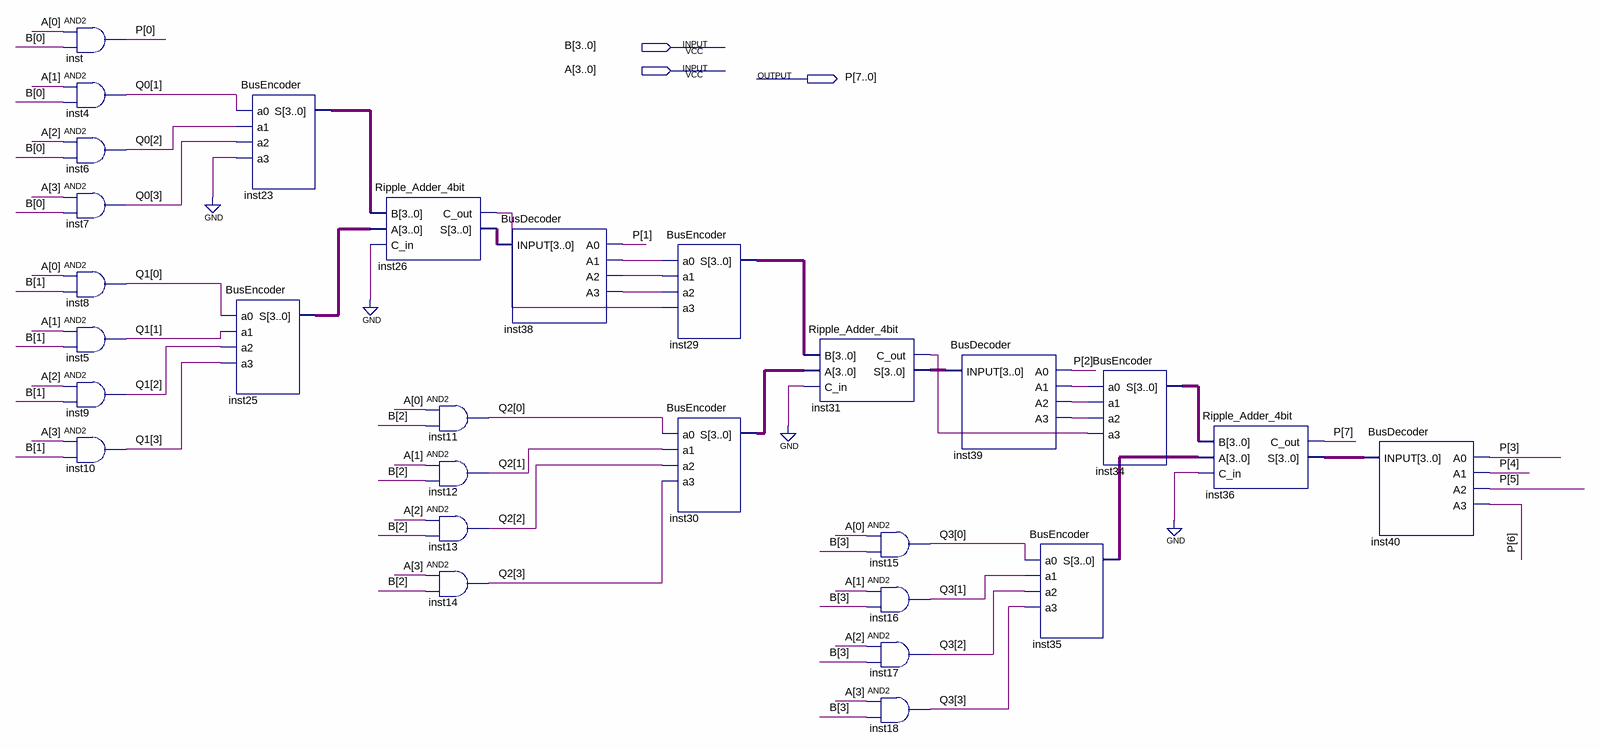
[diagram p0: schematic sheet]
// Quartus schematic Multiplier4Bits.bdf as structural Verilog: 28 symbols, 3 pins
module Multiplier4Bits (
  input  [3:0] B,
  input  [3:0] A,
  output [7:0] P
);

  wire inst26_c_out, inst31_c_out, inst38_a1, inst38_a2, inst38_a3, inst39_a1, inst39_a2, inst39_a3;
  wire [3:0] inst23_s, inst25_s, inst26_s, inst29_s, inst30_s, inst31_s, inst34_s, inst35_s, inst36_s, Q1,
       Q2, Q3;
  wire [3:1] Q0;

  and inst (P[0], A[0], B[0]);
  and inst4 (Q0[1], A[1], B[0]);
  and inst6 (Q0[2], A[2], B[0]);
  and inst7 (Q0[3], A[3], B[0]);
  and inst8 (Q1[0], A[0], B[1]);
  and inst5 (Q1[1], A[1], B[1]);
  and inst9 (Q1[2], A[2], B[1]);
  and inst10 (Q1[3], A[3], B[1]);
  BusEncoder inst25 (.a0(Q1[0]), .a1(Q1[1]), .a2(Q1[2]), .a3(Q1[3]), .S(inst25_s));
  BusEncoder inst23 (.a0(Q0[1]), .a1(Q0[2]), .a2(Q0[3]), .a3(1'b0), .S(inst23_s));
  Ripple_Adder_4bit inst26 (.B(inst23_s), .A(inst25_s), .C_in(1'b0), .C_out(inst26_c_out), .S(inst26_s));
  and inst11 (Q2[0], A[0], B[2]);
  and inst12 (Q2[1], A[1], B[2]);
  and inst13 (Q2[2], A[2], B[2]);
  and inst14 (Q2[3], A[3], B[2]);
  BusDecoder inst38 (.INPUT(inst26_s), .A0(P[1]), .A1(inst38_a1), .A2(inst38_a2), .A3(inst38_a3));
  BusEncoder inst29 (.a0(inst38_a1), .a1(inst38_a2), .a2(inst38_a3), .a3(inst26_c_out), .S(inst29_s));
  BusEncoder inst30 (.a0(Q2[0]), .a1(Q2[1]), .a2(Q2[2]), .a3(Q2[3]), .S(inst30_s));
  Ripple_Adder_4bit inst31 (.B(inst29_s), .A(inst30_s), .C_in(1'b0), .C_out(inst31_c_out), .S(inst31_s));
  and inst15 (Q3[0], A[0], B[3]);
  and inst16 (Q3[1], A[1], B[3]);
  and inst17 (Q3[2], A[2], B[3]);
  and inst18 (Q3[3], A[3], B[3]);
  BusDecoder inst39 (.INPUT(inst31_s), .A0(P[2]), .A1(inst39_a1), .A2(inst39_a2), .A3(inst39_a3));
  BusEncoder inst35 (.a0(Q3[0]), .a1(Q3[1]), .a2(Q3[2]), .a3(Q3[3]), .S(inst35_s));
  BusEncoder inst34 (.a0(inst39_a1), .a1(inst39_a2), .a2(inst39_a3), .a3(inst31_c_out), .S(inst34_s));
  Ripple_Adder_4bit inst36 (.B(inst34_s), .A(inst35_s), .C_in(1'b0), .C_out(P[7]), .S(inst36_s));
  BusDecoder inst40 (.INPUT(inst36_s), .A0(P[3]), .A1(P[4]), .A2(P[5]), .A3(P[6]));
endmodule
